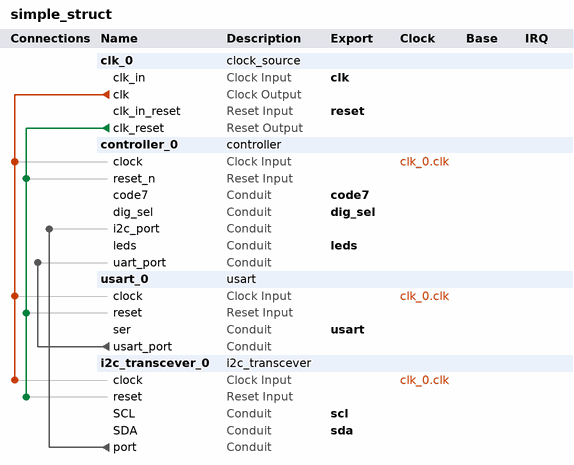
[diagram p0: system contents]
# Platform Designer (Qsys) system simple_struct, Cyclone IV E EP4CE6E22C8
# Parameters at their usual value, and those the tool derives, are not listed.
package require -exact qsys 21.1
create_system simple_struct
set_project_property DEVICE_FAMILY {Cyclone IV E}
set_project_property DEVICE EP4CE6E22C8

add_instance clk_0 clock_source 21.1
set_instance_parameter_value clk_0 clockFrequency 50000000

add_instance controller_0 controller 1.0

add_instance usart_0 usart 1.0
set_instance_parameter_value usart_0 BAUD_RATE 9600
set_instance_parameter_value usart_0 CLK_FREQ_HZ 50000000
set_instance_parameter_value usart_0 DATA_BITS 8
set_instance_parameter_value usart_0 PARITY 0
set_instance_parameter_value usart_0 STOP_BITS 1

add_instance i2c_transcever_0 i2c_transcever 1.0
set_instance_parameter_value i2c_transcever_0 bus_clk 100000
set_instance_parameter_value i2c_transcever_0 input_clk 50000000

# connections
add_connection clk_0.clk controller_0.clock clock
add_connection clk_0.clk i2c_transcever_0.clock clock
add_connection clk_0.clk usart_0.clock clock
add_connection clk_0.clk_reset controller_0.reset_n reset
add_connection clk_0.clk_reset i2c_transcever_0.reset reset
add_connection clk_0.clk_reset usart_0.reset reset
add_connection i2c_transcever_0.port controller_0.i2c_port conduit
add_connection usart_0.usart_port controller_0.uart_port conduit

# exported interfaces
add_interface clk clock sink
set_interface_property clk EXPORT_OF clk_0.clk_in
add_interface code7 conduit end
set_interface_property code7 EXPORT_OF controller_0.code7
add_interface dig_sel conduit end
set_interface_property dig_sel EXPORT_OF controller_0.dig_sel
add_interface leds conduit end
set_interface_property leds EXPORT_OF controller_0.leds
add_interface reset reset sink
set_interface_property reset EXPORT_OF clk_0.clk_in_reset
add_interface scl conduit end
set_interface_property scl EXPORT_OF i2c_transcever_0.SCL
add_interface sda conduit end
set_interface_property sda EXPORT_OF i2c_transcever_0.SDA
add_interface usart conduit end
set_interface_property usart EXPORT_OF usart_0.ser

set_interconnect_requirement {$system} qsys_mm.clockCrossingAdapter HANDSHAKE
set_interconnect_requirement {$system} qsys_mm.enableEccProtection FALSE
set_interconnect_requirement {$system} qsys_mm.insertDefaultSlave FALSE
set_interconnect_requirement {$system} qsys_mm.maxAdditionalLatency 1

save_system simple_struct.qsys
